# EAGLE board CPU (EAGLE 9.3.0)
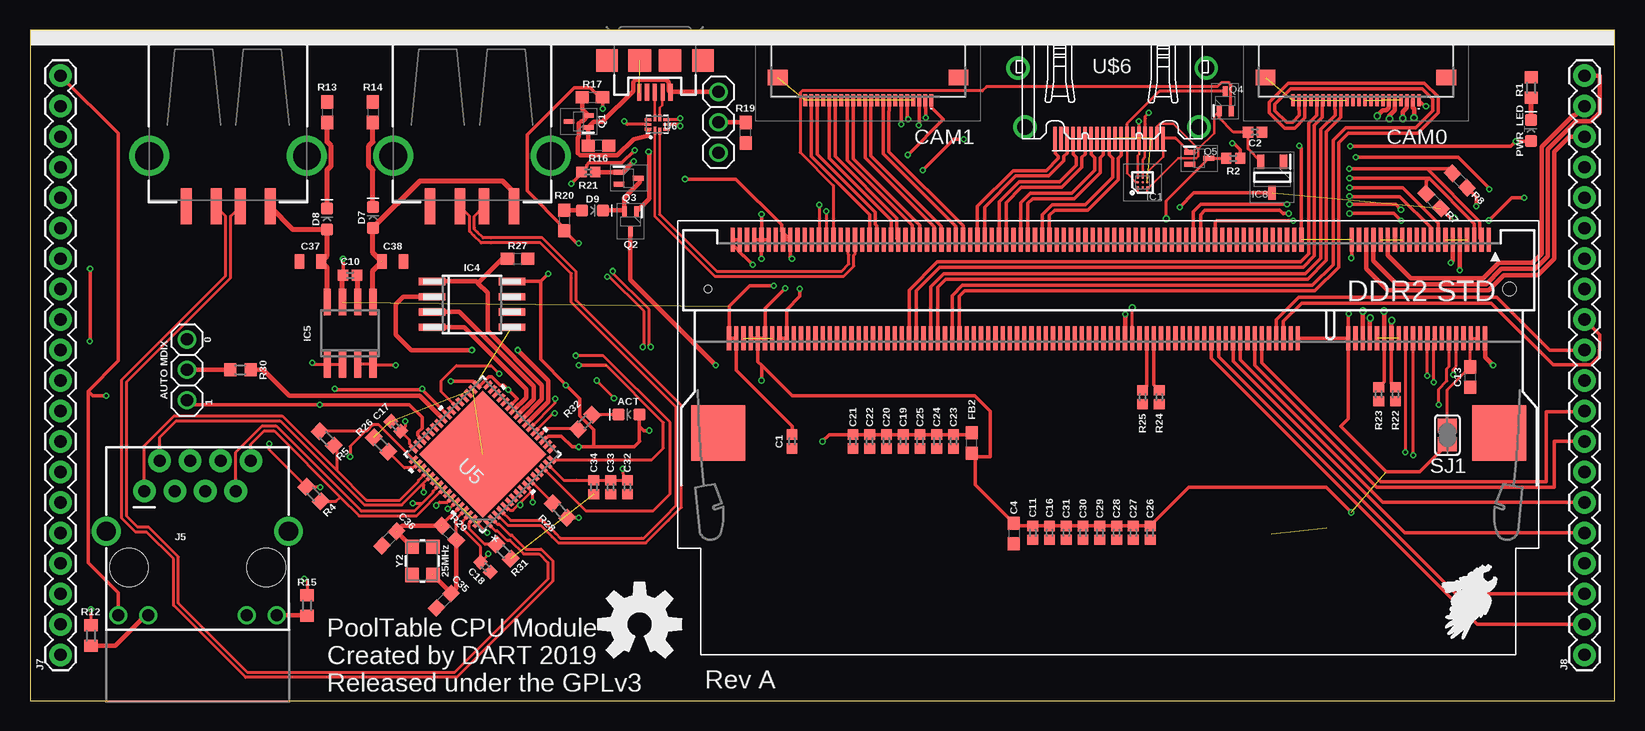
[diagram p2: board, top side]
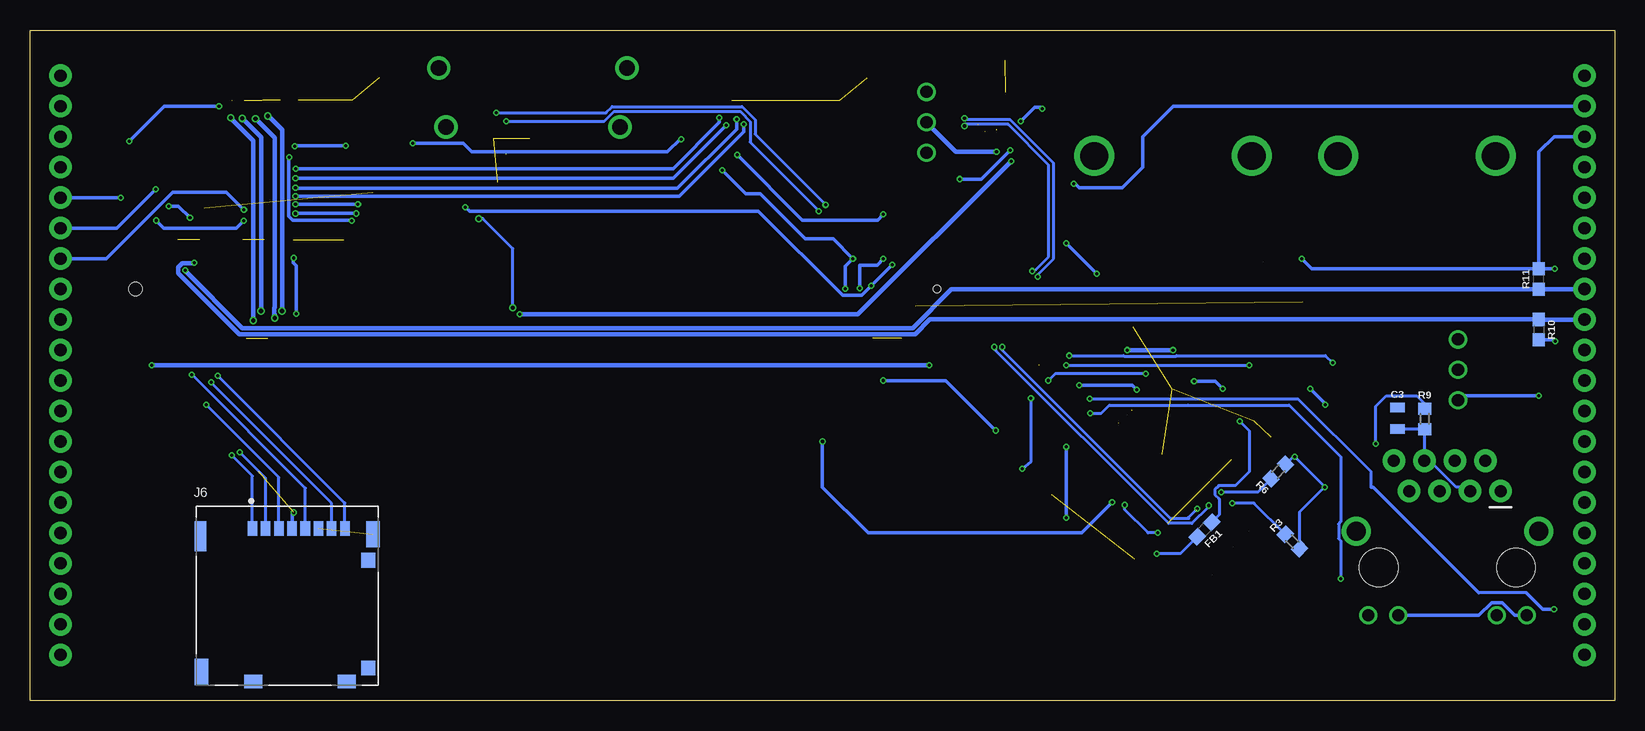
[diagram p3: board, bottom side, seen from below]

Size 132.08 x 55.88 mm. Coordinates in mm from the lower left corner, seen from the top.
Outline: 0,0 132.08,0 132.08,55.88 0,55.88 0,0
Copper layers (1*16): Top 0.035559375mm / dielectric 1.6mm / Bottom 0.035559375mm
Design rules "oshpark-2layer": minimum track width 6mil, minimum drill 10mil, track to track 6mil, track to pad 6mil, pad to pad 6mil, via to via 6mil, smd to smd 6mil, copper to edge 15mil, drill to drill 6mil, minimum pad ring 5mil, minimum via ring 5mil, stop-mask expansion 2.5mil, vias tented up to drill 0mil, thermal gap 10mil
Net classes: 0 default: width 0.254 mm; 1 diff pair: width 0.254 mm; 2 pwr: width 0.305 mm; 3 bga: width 0.152 mm

## Footprints (pad centres in the part's own frame; a part is rotated, then mirrored left to right if it is on the bottom)
0402 = smd 0.85 x 0.9: 1 -0.58,0; 2 0.58,0
0805 = smd 0.8 x 1.2: 1 -0.9,0; 2 0.9,0
0603 = smd 1.1 x 1: 1 -0.85,0; 2 0.85,0
545482271 = smd 0.3 x 1: 1 5.25,2.05; 2 4.75,2.05; 3 4.25,2.05; 4 3.75,2.05; 5 3.25,2.05; 6 2.75,2.05; 7 2.25,2.05; 8 1.75,2.05; 9 1.25,2.05; 10 0.75,2.05; 11 0.25,2.05; 12 -0.25,2.05; 13 -0.75,2.05; 14 -1.25,2.05; 15 -1.75,2.05; 16 -2.25,2.05; 17 -2.75,2.05; 18 -3.25,2.05; 19 -3.75,2.05; 20 -4.25,2.05; 21 -4.75,2.05; 22 -5.25,2.05 | smd 1.65 x 1.3: 23 -7.525,0.15; 24 7.525,0.15
RPI_COMPUTE = smd 0.35 x 2: 1 -31.38,-4.1; 2 -31.08,4.1; 3 -30.78,-4.1; 4 -30.48,4.1; 5 -30.18,-4.1; 6 -29.88,4.1; 7 -29.58,-4.1; 8 -29.28,4.1; 9 -28.98,-4.1; 10 -28.68,4.1; 11 -28.38,-4.1; 12 -28.08,4.1; 13 -27.78,-4.1; 14 -27.48,4.1; 15 -27.18,-4.1; 16 -26.88,4.1; 17 -26.58,-4.1; 18 -26.28,4.1; 19 -25.98,-4.1; 20 -25.68,4.1; 21 -25.38,-4.1; 22 -25.08,4.1; 23 -24.78,-4.1; 24 -24.48,4.1; 25 -24.18,-4.1; 26 -23.88,4.1; 27 -23.58,-4.1; 28 -23.28,4.1; 29 -22.98,-4.1; 30 -22.68,4.1; 31 -22.38,-4.1; 32 -22.08,4.1; 33 -21.78,-4.1; 34 -21.48,4.1; 35 -21.18,-4.1; 36 -20.88,4.1; 37 -20.58,-4.1; 38 -20.28,4.1; 39 -19.98,-4.1; 40 -19.68,4.1; 41 -15.78,-4.1; 42 -15.48,4.1; 43 -15.18,-4.1; 44 -14.88,4.1; 45 -14.58,-4.1; 46 -14.28,4.1; 47 -13.98,-4.1; 48 -13.68,4.1; 49 -13.38,-4.1; 50 -13.08,4.1; 51 -12.78,-4.1; 52 -12.48,4.1; 53 -12.18,-4.1; 54 -11.88,4.1; 55 -11.58,-4.1; 56 -11.28,4.1; 57 -10.98,-4.1; 58 -10.68,4.1; 59 -10.38,-4.1; 60 -10.08,4.1; 61 -9.78,-4.1; 62 -9.48,4.1; 63 -9.18,-4.1; 64 -8.88,4.1; 65 -8.58,-4.1; 66 -8.28,4.1; 67 -7.98,-4.1; 68 -7.68,4.1; 69 -7.38,-4.1; 70 -7.08,4.1; 71 -6.78,-4.1; 72 -6.48,4.1; 73 -6.18,-4.1; 74 -5.88,4.1; 75 -5.58,-4.1; 76 -5.28,4.1; 77 -4.98,-4.1; 78 -4.68,4.1; 79 -4.38,-4.1; 80 -4.08,4.1; 81 -3.78,-4.1; 82 -3.48,4.1; 83 -3.18,-4.1; 84 -2.88,4.1; 85 -2.58,-4.1; 86 -2.28,4.1; 87 -1.98,-4.1; 88 -1.68,4.1; 89 -1.38,-4.1; 90 -1.08,4.1; 91 -0.78,-4.1; 92 -0.48,4.1; 93 -0.18,-4.1; 94 0.12,4.1; 95 0.42,-4.1; 96 0.72,4.1; 97 1.02,-4.1; 98 1.32,4.1; 99 1.62,-4.1; 100 1.92,4.1; 101 2.22,-4.1; 102 2.52,4.1; 103 2.82,-4.1; 104 3.12,4.1; 105 3.42,-4.1; 106 3.72,4.1; 107 4.02,-4.1; 108 4.32,4.1; 109 4.62,-4.1; 110 4.92,4.1; 111 5.22,-4.1; 112 5.52,4.1; 113 5.82,-4.1; 114 6.12,4.1; 115 6.42,-4.1; 116 6.72,4.1; 117 7.02,-4.1; 118 7.32,4.1; 119 7.62,-4.1; 120 7.92,4.1; 121 8.22,-4.1; 122 8.52,4.1; 123 8.82,-4.1; 124 9.12,4.1; 125 9.42,-4.1; 126 9.72,4.1; 127 10.02,-4.1; 128 10.32,4.1; 129 10.62,-4.1; 130 10.92,4.1; 131 11.22,-4.1; 132 11.52,4.1; 133 11.82,-4.1; 134 12.12,4.1; 135 12.42,-4.1; 136 12.72,4.1; 137 13.02,-4.1; 138 13.32,4.1; 139 13.62,-4.1; 140 13.92,4.1; 141 14.22,-4.1; 142 14.52,4.1; 143 14.82,-4.1; 144 15.12,4.1; 145 15.42,-4.1; 146 15.72,4.1; 147 16.02,-4.1; 148 16.32,4.1; 149 16.62,-4.1; 150 16.92,4.1; 151 17.22,-4.1; 152 17.52,4.1; 153 17.82,-4.1; 154 18.12,4.1; 155 18.42,-4.1; 156 18.72,4.1; 157 19.02,-4.1; 158 19.32,4.1; 159 19.62,-4.1; 160 19.92,4.1; 161 20.22,-4.1; 162 20.52,4.1; 163 20.82,-4.1; 164 21.12,4.1; 165 21.42,-4.1; 166 21.72,4.1; 167 22.02,-4.1; 168 22.32,4.1; 169 22.62,-4.1; 170 22.92,4.1; 171 23.22,-4.1; 172 23.52,4.1; 173 23.82,-4.1; 174 24.12,4.1; 175 24.42,-4.1; 176 24.72,4.1; 177 25.02,-4.1; 178 25.32,4.1; 179 25.62,-4.1; 180 25.92,4.1; 181 26.22,-4.1; 182 26.52,4.1; 183 26.82,-4.1; 184 27.12,4.1; 185 27.42,-4.1; 186 27.72,4.1; 187 28.02,-4.1; 188 28.32,4.1; 189 28.62,-4.1; 190 28.92,4.1; 191 29.22,-4.1; 192 29.52,4.1; 193 29.82,-4.1; 194 30.12,4.1; 195 30.42,-4.1; 196 30.72,4.1; 197 31.02,-4.1; 198 31.32,4.1; 199 31.62,-4.1; 200 31.92,4.1 | smd 4.5 x 4.6: M1 -32.28,12; M2 32.82,12 | hole 1.1: -33.13,0 | hole 0.6: 33.67,0
LED-0603 = smd 1 x 1: A -0.877,0; C 0.877,0
BGA9C40P3X3_114X114X63 = smd 0.212 x 0.212: A1 -0.4,0.4; A2 0,0.4; A3 0.4,0.4; B1 -0.4,0; B2 0,0; B3 0.4,0; C1 -0.4,-0.4; C2 0,-0.4; C3 0.4,-0.4
SO-08M = smd 0.6 x 2.2: 1 -1.905,-3.33; 2 -0.635,-3.33; 3 0.635,-3.33; 4 1.905,-3.33; 5 1.905,3.33; 6 0.635,3.33; 7 -0.635,3.33; 8 -1.905,3.33
SO08 = smd 0.6 x 2.2: 1 -1.905,-2.6; 2 -0.635,-2.6; 3 0.635,-2.6; 4 1.905,-2.6; 5 1.905,2.6; 6 0.635,2.6; 7 -0.635,2.6; 8 -1.905,2.6
SOT95P285X130-3N = smd 1.15 x 0.6: 1 -1.3,0.95; 2 -1.3,-0.95; 3 1.3,0
USB-A-S-SILK-FEMALE = smd 3 x 0.9: D+ 7.212,-1; D- 7.212,1; GND 7.212,-3.5; VBUS 7.212,3.5 | drill 2.311: SHLD1 3,-6.566; SHLD2 3,6.566
USB-MICROB = smd 1.4 x 0.35: D+ -2.65,0; D- -2.65,-0.65; GND -2.65,1.3; ID -2.65,0.65; VBUS -2.65,-1.3 | smd 1.9 x 1.8: MT1 0,-4; MT2 0,4 | smd 1.9 x 1.9: P$1 0,-1.27; P$2 0,1.27
MAGJACK = drill 1 pad 1.88: 1 3.175,17.445; 2 4.445,19.985; 3 5.715,17.445; 4 6.985,19.985; 5 8.255,17.445; 6 9.525,19.985; 7 10.795,17.445; 8 12.065,19.985 | drill 1 pad 1.27: 9 1,7.1; 10 3.5,7.1; 11 11.7,7.1; 12 14.2,7.1 | drill 1.6 pad 2.184: M1 0,14.1; M2 15.2,14.1 | hole 3.2: 1.905,11.095; 13.335,11.095
MOLEX_503182-1853 = smd 0.8 x 1.24: 1 -2.9,5.605; 2 -1.8,5.605; 3 -0.7,5.605; 4 0.4,5.605; 5 1.5,5.605; 6 2.6,5.605; 7 3.7,5.605; 8 4.8,5.605 | smd 1.16 x 1.2: DET_T 6.74,-6.025 | smd 0.95 x 2.5: SH1 -7.245,4.975 | smd 1.15 x 2.2: SH2 7.145,5.125; SH5 -7.145,-6.355 | smd 1.5 x 1.15: SH3 4.94,-7.15; SH4 -2.84,-7.15 | smd 1.16 x 1.25: SW_T 6.74,2.975
1X20 = drill 1.016 pad 1.88: 1 0,0; 2 2.54,0; 3 5.08,0; 4 7.62,0; 5 10.16,0; 6 12.7,0; 7 15.24,0; 8 17.78,0; 9 20.32,0; 10 22.86,0; 11 25.4,0; 12 27.94,0; 13 30.48,0; 14 33.02,0; 15 35.56,0; 16 38.1,0; 17 40.64,0; 18 43.18,0; 19 45.72,0; 20 48.26,0
1X03 = drill 1.016: 1 -2.54,0; 2 0,0; 3 2.54,0
SOT50P160X80-3N = smd 0.9 x 0.4: 1 -0.8,0.5; 2 -0.8,-0.5; 3 0.8,0
R0603 = smd 1 x 1.1: 1 -0.85,0; 2 0.85,0
SJ = smd 1.168 x 1.6: 1 -0.762,0; 2 0.762,0
QFN64_9X9MC = smd 0.813 x 0.305: 1 -4.394,3.75; 2 -4.394,3.25; 3 -4.394,2.75; 4 -4.394,2.25; 5 -4.394,1.75; 6 -4.394,1.25; 7 -4.394,0.75; 8 -4.394,0.25; 9 -4.394,-0.25; 10 -4.394,-0.75; 11 -4.394,-1.25; 12 -4.394,-1.75; 13 -4.394,-2.25; 14 -4.394,-2.75; 15 -4.394,-3.25; 16 -4.394,-3.75; 33 4.394,-3.75; 34 4.394,-3.25; 35 4.394,-2.75; 36 4.394,-2.25; 37 4.394,-1.75; 38 4.394,-1.25; 39 4.394,-0.75; 40 4.394,-0.25; 41 4.394,0.25; 42 4.394,0.75; 43 4.394,1.25; 44 4.394,1.75; 45 4.394,2.25; 46 4.394,2.75; 47 4.394,3.25; 48 4.394,3.75 | smd 0.305 x 0.813: 17 -3.75,-4.394; 18 -3.25,-4.394; 19 -2.75,-4.394; 20 -2.25,-4.394; 21 -1.75,-4.394; 22 -1.25,-4.394; 23 -0.75,-4.394; 24 -0.25,-4.394; 25 0.25,-4.394; 26 0.75,-4.394; 27 1.25,-4.394; 28 1.75,-4.394; 29 2.25,-4.394; 30 2.75,-4.394; 31 3.25,-4.394; 32 3.75,-4.394; 49 3.75,4.394; 50 3.25,4.394; 51 2.75,4.394; 52 2.25,4.394; 53 1.75,4.394; 54 1.25,4.394; 55 0.75,4.394; 56 0.25,4.394; 57 -0.25,4.394; 58 -0.75,4.394; 59 -1.25,4.394; 60 -1.75,4.394; 61 -2.25,4.394; 62 -2.75,4.394; 63 -3.25,4.394; 64 -3.75,4.394 | smd 7.493 x 7.493: 65 0,0
IC_FSUSB42UMX = smd 0.663 x 0.225: 1 -0.518,0.2 | smd 0.563 x 0.225: 2 -0.569,-0.2; 6 0.569,-0.2; 7 0.569,0.2 | smd 0.225 x 0.563: 3 -0.4,-0.768; 4 0,-0.768; 5 0.4,-0.768; 8 0.4,0.768; 9 0,0.768; 10 -0.4,0.768
HDMI_A = smd 0.3 x 1.9: P$1 4.75,3.95; P$2 4.25,3.95; P$3 3.75,3.95; P$4 3.25,3.95; P$5 2.75,3.95; P$6 2.25,3.95; P$7 1.75,3.95; P$8 1.25,3.95; P$9 0.75,3.95; P$10 0.25,3.95; P$11 -0.25,3.95; P$12 -0.75,3.95; P$13 -1.25,3.95; P$14 -1.75,3.95; P$15 -2.25,3.95; P$16 -2.75,3.95; P$17 -3.25,3.95; P$18 -3.75,3.95; P$19 -4.25,3.95 | drill 1.3: P$20 -7.25,3; P$21 7.25,3; P$22 7.85,-1.9; P$23 -7.85,-1.9
CRYSTAL-SMD-3.2X2.5MM = smd 1.2 x 1.1: 1 -1.175,-0.875; 2 1.175,-0.875; 3 1.175,0.875; 4 -1.175,0.875

## Placement (x,y rotation side)
C1  0.1uF  [0402]  63.5,21.59 90 top
C2  0.1uF  [0402]  102.08,47.37 0 top
C3  0.022uF/50V  [0805]  18.14,23.52 270 bottom
C4  4.7uF  [0603]  81.99,13.92 270 top
C10  1.0uF  [0402]  26.67,35.43 180 top
C11  0.1uF  [0402]  83.57,13.97 90 top
C13  4.7uF  [0603]  120.04,26.95 90 top
C16  0.1uF  [0402]  84.96,13.97 270 top
C17  0.1uF  [0402]  30.48,22.86 315 top
C18  1.0uF  [0402]  37.96,11.12 135 top
C19  0.1uF  [0402]  72.77,21.59 90 top
C20  0.1uF  [0402]  71.37,21.59 90 top
C21  0.1uF  [0402]  68.58,21.59 90 top
C22  0.1uF  [0402]  69.98,21.59 90 top
C23  0.1uF  [0402]  76.96,21.59 90 top
C24  0.1uF  [0402]  75.56,21.59 90 top
C25  0.1uF  [0402]  74.17,21.59 90 top
C26  0.1uF  [0402]  93.34,13.97 90 top
C27  0.1uF  [0402]  91.95,13.97 90 top
C28  0.1uF  [0402]  90.55,13.97 90 top
C29  0.1uF  [0402]  89.15,13.97 90 top
C30  0.1uF  [0402]  87.76,13.97 90 top
C31  4.7uF  [0402]  86.36,13.97 90 top
C32  0.1uF  [0402]  49.78,17.78 90 top
C33  0.1uF  [0402]  48.39,17.78 90 top
C34  4.7uF  [0402]  46.99,17.78 90 top
C35  33pF  [0603]  34.48,8.32 225 top
C36  33pF  [0603]  29.94,13.51 225 top
C37  47uF/6.3V  [0805]  23.37,36.58 180 top
C38  47uF/6.3V  [0805]  30.23,36.58 0 top
CAM0  54548-2271  [545482271]  110.49,52.07 180 top
CAM1  54548-2271  [545482271]  69.85,52.07 180 top
CPU1  RPI_COMPUTE  [RPI_COMPUTE]  90.17,34.29 180 top
D7  GREEN  [LED-0603]  28.57,40.26 90 top
D8  GREEN  [LED-0603]  24.77,40.13 90 top
D9  GREEN  [LED-0603]  46.89,40.84 0 top
D10-FULLDUPLEX  GREEN  [LED-0603]  49.91,23.85 180 top
FB1  0.05Ω/2A  [0603]  34.21,14.25 225 bottom
FB2  0.05Ω/2A  [0603]  78.49,21.46 90 top
IC1  ESD5384NCTBG  [BGA9C40P3X3_114X114X63]  92.71,43.18 90 top
IC4  93LC66SM  [SO-08M]  36.83,33.02 270 top
IC5  MIC2026-1YM  [SO08]  26.67,30.61 0 top
IC8  AP2331W-7  [SOT95P285X130-3N]  103.5,43.61 270 top
J1  USB_A_SMT_FEMALE  [USB-A-S-SILK-FEMALE]  36.83,48.39 270 top
J2  USB_A_SMT_FEMALE  [USB-A-S-SILK-FEMALE]  16.51,48.39 270 top
J3  [USB-MICROB]  52.07,53.34 90 top
J5  MAGJACK  [MAGJACK]  6.35,0 0 top
J6  503182-1853  [MOLEX_503182-1853]  110.64,8.74 0 bottom
J7  [1X20]  2.54,3.81 90 top
J8  [1X20]  129.54,3.81 90 top
JP1  [1X03]  57.38,48.18 270 top
JP2  [1X03]  13.08,27.56 90 top
PWR_LED  GREEN  [LED-0603]  125.09,47.5 90 top
Q1  DMG1012T-7  [SOT50P160X80-3N]  45.72,48.26 180 top
Q2  DMG1012T-7  [SOT50P160X80-3N]  50.04,39.93 270 top
Q3  DMG1012T-7  [SOT50P160X80-3N]  49.89,43.54 0 top
Q4  DMG1012T-7  [SOT50P160X80-3N]  99.59,49.96 90 top
Q5  DMG1012T-7  [SOT50P160X80-3N]  97.43,45.19 0 top
R1  332R  [R0603]  125.09,51.08 270 top
R2  100K  [0402]  100.28,45.19 180 top
R3  49.9R  [R0603]  26.88,13.25 315 bottom
R4  49.9R  [R0603]  23.63,17.2 135 top
R5  49.9R  [R0603]  24.72,21.85 135 top
R6  49.9R  [R0603]  28.06,19.08 45 bottom
R7  4.7k  [0603]  116.96,41.64 315 top
R8  4.7k  [0603]  119.15,43.35 315 top
R9  10R  [R0603]  15.85,23.47 90 bottom
R10  4.7k  [0603]  6.35,30.91 270 bottom
R11  4.7k  [0603]  6.35,35.13 90 bottom
R12  332R  [R0603]  5.08,5.41 90 top
R13  150  [0603]  24.77,49.02 270 top
R14  150  [0603]  28.57,49.02 270 top
R15  332R  [R0603]  23.09,7.92 90 top
R16  47k  [0603]  47.37,46.25 180 top
R17  47k  [0603]  46.86,50.27 0 top
R19  47k  [0603]  59.64,47.32 90 top
R20  150  [0603]  44.53,40.01 270 top
R21  100K  [0402]  46.53,44.04 0 top
R22  100K  [0402]  113.79,25.53 270 top
R23  100K  [0402]  112.39,25.53 270 top
R24  100K  [0402]  94.11,25.27 270 top
R25  100K  [0402]  92.71,25.27 270 top
R26  12.4K  [R0603]  29.25,21.34 315 top
R27  10k  [0603]  40.64,36.83 0 top
R28  12.4K  [R0603]  44.15,15.84 135 top
R29  1M  [0603]  34.93,13.98 135 top
R30  10K  [R0603]  17.53,27.56 0 top
R31  12K  [R0603]  39.47,12.42 135 top
R32  332R  [R0603]  46.26,23.22 45 top
SJ1  [SJ]  118.11,22.12 270 top
U5  LAN9512-JZX  [QFN64_9X9MC]  37.72,20.52 135 top
U6  FSUSB42UMX  [IC_FSUSB42UMX]  52.27,48.01 90 top
U$1  [OSHW-LOGO-L]  50.8,6.35 0 top
U$6  HDMI-A  [HDMI_A]  90.17,50.8 180 top
Y2  25MHz  [CRYSTAL-SMD-3.2X2.5MM]  32.7,11.64 90 top

## Tracks (layer width: path | path; a pad name or v marks a point on that pad's centre or on a via)
1.8V  (via drill 0.25)
  Top 0.305: v45.11,43.08 45.95,43.92 R21.1 46.38,44.47 46.38,44.62 46.56,44.8 49.32,44.8 v50.39,45.87 | CPU1.183 CPU1.185 | CPU1.186 CPU1.184 63.05,32.57 64.16,33.68 64.16,34.27 64.14,34.29 v64.14,34.31 | v63.5,36.83 63.35,36.98 CPU1.183 | CPU1.183 62.63,39.11 62.63,39.63 58.8,43.46 v54.59,43.46 | R2.1 100.86,45.9 100.33,46.43 v100.18,46.43 | v77.83,46.79 76.99,46.79 v74.4,44.2
  Bottom 0.305: J7.19 36.83,49.53 39.37,46.99 39.37,44.45 41.07,42.75 44.65,42.75 44.98,43.08 v45.11,43.08 | v64.14,34.31 64.14,36.2 v63.5,36.83 65.15,38.48 67.46,38.48 71.22,42.24 72.44,42.24 v74.4,44.2 | v54.59,43.46 52.81,43.46 v50.39,45.87 | v100.18,46.43 95.96,46.43 95.25,45.72 78.97,45.72 77.85,46.84 77.83,46.81 v77.83,46.79
3.3V  (via drill 0.25)  (2 unrouted)
  Top 0.254: U6.9 49.78,48.01
  Top 0.305: U5.46 32.67,21.75 32.32,22.09 32.32,22.34 32.67,22.69 32.67,23.62 31.62,24.66 v24.13,24.66 13.44,24.66 JP2.1 | 32.69,25.88 34.76,23.81 U5.40 U5.39 | v25.4,25.98 25.5,25.88 32.69,25.88 | U5.19 42.83,21.69 43.18,22.03 44.29,22.03 45.19,21.13 v45.72,21.13 46.99,21.13 | 46.99,21.13 50.34,21.13 50.8,21.59 50.79,21.6 50.79,22.86 | 50.79,22.86 D10-FULLDUPLEX.A | J7.20 7.35,47.26 7.35,28.3 4.84,25.79 | J5.9 7.35,8.98 4.84,11.49 4.84,25.79 | v47.73,49.3 47.71,49.31 R17.2 47.49,50.27 46.69,51.07 45.34,51.07 41.43,47.16 41.43,42.47 44.53,39.37 R20.2 45.58,38.1 v45.72,38.1 | 49.78,48.01 v49.52,48.27 | 4.84,25.79 5.24,25.4 v6.35,25.4 | IC4.8 42.55,34.92 | 42.55,34.92 v43.18,35.56 | CPU1.193 CPU1.191 | CPU1.189 CPU1.191 | CPU1.194 CPU1.192 | CPU1.192 CPU1.190 61.25,32.67 v62.94,34.37 | v60.96,36.83 v60.95,36.84 CPU1.191 | FB2.1 78.78,20.32 | 78.78,20.32 80.01,20.32 80.01,24.13 78.74,25.4 63.5,25.4 60.96,27.94 | CPU1.192 60.65,28.25 60.96,27.94 | CAM1.22 75.1,49.46 76.12,48.44 73.18,45.49 73.15,45.49 v73.15,45.47 | v60.96,40.51 CPU1.191 | R28.1 v45.72,15.24 | 60.96,27.94 v60.96,26.67 | v51.59,22.5 51.14,22.5 50.79,22.86 | 78.78,20.32 78.78,17.98 C4.1 82.21,14.55 C11.2 C16.1 C31.2 C30.2 C29.2 C28.2 C27.2 C26.2 96.58,17.78 108,17.78 v110.11,15.67 | CPU1.40 CPU1.42 | CPU1.40 109.85,32.2 v109.88,32.23 | v110.11,36.88 110.15,36.92 CPU1.39 | SJ1.2 115.8,19.05 113.03,19.05 109.22,22.86 109.85,23.49 CPU1.40 | CAM0.22 116.23,49.53 v116.33,49.53 | PWR_LED.A v123.8,46.61 123.39,46.2 v110.03,46.2 | U5.27 40.59,25.16 v39.86,25.89 39.47,26.28 39.18,26.28 38.48,26.98 38.23,26.98 37.53,26.28 U5.33 36.92,26.63 36.6,26.63 36.59,26.62 v35.08,26.62
  Top 0.305: v32.69,25.98 32.69,25.88 | 42.55,34.92 42.55,28.42 44.68,26.29 | 44.68,26.29 v44.65,26.26 | 44.68,26.29 45.82,25.15 45.82,23.73 46.99,22.56 46.99,21.13 | CPU1.41 105.95,46.04 v105.77,46.23
  Bottom 0.305: v25.4,25.98 24.13,24.71 v24.13,24.66 | J5.9 8.36,7.1 9.41,8.15 10.29,8.15 11.34,7.1 J5.11 | v49.52,48.27 48.34,49.45 47.88,49.45 v47.73,49.3 | v6.35,25.4 12.7,25.4 JP2.1 | v43.18,35.56 v45.72,38.1 | v62.94,34.37 62.94,36.3 61.49,36.3 v60.96,36.83 | v73.15,45.47 67.72,40.03 61.44,40.03 v60.96,40.51 | v45.72,15.24 v45.72,21.13 | v60.96,26.67 55.75,26.67 v51.59,22.5 | J6.4 110.24,15.54 v110.11,15.67 | v109.88,32.23 109.88,36.22 110.13,36.47 110.13,36.85 v110.11,36.88 | v116.33,49.53 120.88,49.53 v123.8,46.61 | v35.08,26.62 33.32,26.62 v32.69,25.98 | v44.65,26.26 40.23,26.26 v39.86,25.89 | v105.77,46.23 110.01,46.23 v110.03,46.2
5V  (via drill 0.25)  (2 unrouted)
  Top 0.305: v5,35.99 5,29.97 v4.98,29.95 | C10.2 v26.09,36.8 | CPU1.197 CPU1.199 58.55,37.98 59.45,37.09 59.46,37.09 v60.22,36.32 | 62,34.57 v61.98,34.57 59.97,34.57 58.25,32.85 CPU1.200 CPU1.198 58.85,27.51 63.5,22.86 C1.2 | R7.2 118.36,40.23 v118.75,40.23 | v120.52,41.2 120.52,41.97 R8.2 | IC8.3 97,42.31 v95.81,41.12
  Top 0.406: IC5.7 26.04,35.38 C10.2
  Bottom 0.305: R11.2 6.35,45.72 5.08,46.99 J7.18 | R11.2 5.02,35.98 v5,35.99 | v4.98,29.95 5.09,30.06 R10.2 | R11.2 25.26,35.98 v26.09,36.8 | v60.22,36.32 60.25,36.32 60.27,36.3 60.27,36.27 v61.98,34.57 62.38,34.16 62.38,34.13 62.76,33.76 64.37,33.76 71.37,40.76 95.45,40.76 v95.81,41.12 | v118.75,40.23 119.71,41.2 v120.52,41.2
CAM0_C_N
  Top 0.305: CPU1.144 75.05,34.51 76.13,35.59 106.28,35.59 107.57,36.87 107.57,47.59 108.76,48.79 108.76,49.25 108.74,49.27 CAM0.8
CAM0_C_P
  Top 0.305: CPU1.142 75.65,34.46 76.32,35.13 106.47,35.13 108.03,36.69 108.03,47.4 109.22,48.6 109.22,50 CAM0.9
CAM0_D0_N
  Top 0.305: CPU1.138 76.85,33.74 77.71,34.59 106.86,34.59 108.58,36.31 108.58,46.68 109.66,47.75 115.47,47.75 116.89,49.17 116.89,50.12 116.01,51 105.05,51 103.73,49.69 103.73,49.17 104.72,48.18 105.21,48.18 105.79,48.76 105.79,49.17 105.74,49.23 CAM0.2
CAM0_D0_P
  Top 0.305: CPU1.136 77.45,33.69 77.89,34.14 107.05,34.14 109.04,36.13 109.04,46.49 109.85,47.3 115.67,47.3 117.35,48.98 117.35,50.31 116.2,51.46 104.86,51.46 103.28,49.88 103.28,48.98 104.55,47.7 105.38,47.7 106.25,48.57 106.25,49.36 106.24,49.37 CAM0.3
CAM0_D1_N
  Top 0.305: CPU1.150 73.25,34.2 75.62,36.58 105.9,36.58 106.58,37.26 106.58,48.13 107.24,48.79 107.24,49.4 CAM0.5
CAM0_D1_P
  Top 0.305: CAM0.6 107.7,49.96 107.7,49.83 107.7,48.6 107.04,47.94 107.04,37.07 106.09,36.12 75.81,36.12 73.85,34.16 CPU1.148
CAM1_C_N
  Top 0.305: CAM1.8 68.1,45.01 73.52,39.59 73.52,38.42 CPU1.149
CAM1_C_P
  Top 0.305: CAM1.9 68.6,45.16 74.15,39.61 CPU1.147
CAM1_D0_N
  Top 0.305: CAM1.2 65.1,45.36 65.11,45.36 69.98,40.49 69.98,38.42 CPU1.161
CAM1_D0_P
  Top 0.305: CAM1.3 65.6,45.52 70.43,40.68 70.43,39.7 70.55,39.58 CPU1.159
CAM1_D1_N
  Top 0.305: CAM1.5 66.6,45.19 71.78,40.01 71.78,38.42 CPU1.155
CAM1_D1_P
  Top 0.305: CAM1.6 67.1,45.34 72.24,40.2 72.24,38.5 CPU1.153
CAM1_D2_N
  Top 0.305: CPU1.143 75.35,39.47 69.6,45.22 69.6,49.28 CAM1.11
CAM1_D2_P
  Top 0.305: CPU1.141 75.95,39.51 70.05,45.41 70.05,49.39 70.06,49.4 70.06,49.98 CAM1.12
CAM1_D3_N
  Top 0.305: CPU1.137 77.15,39.52 71.12,45.55 71.12,49.12 71.12,50 CAM1.14
CAM1_D3_P
  Top 0.305: CPU1.135 77.75,39.57 71.58,45.74 71.58,49.12 71.6,49.15 CAM1.15
EMMC_DISABLE_N  (via drill 0.25)
  Top 0.356: Q2.3 50.04,35.05 v57.15,27.94 | v121.92,27.94 121.25,28.61 CPU1.2
  Bottom 0.356: v57.15,27.94 v121.92,27.94
EMMC_EN_N_1V8  (via drill 0.25)
  Top 0.356: R21.2 47.12,44.04 Q3.1 49.4,44.04 v50.32,44.96 | v91.26,32.18 91.26,30.2 CPU1.90
  Bottom 0.356: v50.32,44.96 63.09,32.18 v91.26,32.18
ETH_18ETHPLL  (via drill 0.25)
  Top 0.254: U5.48 31.96,21.07 31.64,21.4 31.64,21.7 C17.2 31.27,22.83 v31.27,23.29
  Bottom 0.254: v31.27,23.29 30.48,22.5 30.48,19.05 31.62,17.91 33.04,17.91 33.35,17.59 33.35,17.15 32.99,16.8 32.99,15.47 FB1.1
ETH_18USBPLL  (via drill 0.25)
  Top 0.254: U5.62 36.04,14.96 36.04,14.3 37.55,12.8 C18.2 38.18,12.16 v38.18,12.24
  Bottom 0.254: FB1.2 36.22,12.24 v38.18,12.24
ETH_EECLK  (via drill 0.25)  (1 unrouted)
  Top 0.356: 41.38,23.1 43.18,24.9 43.18,26.67 v40.64,29.21 | v36.83,29.21 31.75,29.21 30.48,30.48 30.48,33.02 31.11,33.66 IC4.2
  Bottom 0.356: v40.64,29.21 v36.83,29.21
ETH_EECS
  Top 0.356: IC4.1 37.19,34.92 37.33,34.78 | 37.33,34.78 38.12,33.98 38.12,30.81 42.65,26.29 42.65,25.1 U5.24 | 37.33,34.78 39.37,36.83 R27.1
ETH_EEDI  (1 unrouted)
  Top 0.356: IC4.4 36.2,31.11 41.35,25.96 41.35,25.24 40.28,24.17
ETH_EEDO  (1 unrouted)
  Top 0.356: IC4.3 35.76,32.38 41.96,26.19 41.96,25.13 U5.25
ETH_PWR2
  Top 0.406: IC5.8 24.77,36.08 C37.1 24.77,37.07 D8.A 21.93,39.26 J2.VBUS
ETH_PWR3  (2 unrouted)
  Top 0.406: IC5.5 28.57,35.83 C38.1 28.57,37.33 D7.A 32.5,43.31 39.37,43.31 40.39,42.29 40.39,41.23 J1.VBUS
ETH_USB_D2_N
  Top 0.254: U5.1 38.79,14.15 38.91,14.15 38.91,14.19 39.73,13.37 39.99,13.37 41.14,12.22 42.44,12.22 43.16,11.5 43.16,10.12 35.37,2.34 18.14,2.34 12.37,8.11 12.37,11.97 9.89,14.45 8.97,14.45 8.05,15.38 8.05,26.56 16.71,35.22 16.71,40.38 J2.D-
ETH_USB_D2_P
  Top 0.254: U5.2 38.94,14.71 39.1,14.71 40.02,13.78 40.15,13.78 41.31,12.62 42.6,12.62 43.56,11.67 43.56,9.95 35.54,1.93 17.98,1.93 11.96,7.94 11.96,11.8 9.72,14.05 8.81,14.05 7.64,15.21 7.64,26.73 16.31,35.39 16.31,40.38 J2.D+
ETH_USB_D3_N
  Top 0.254: U5.3 38.96,15.47 39.82,14.61 40.23,14.61 42.04,14.61 42.56,14.61 43.52,13.65 44.04,13.13 50.98,13.13 51.32,13.13 53.2,15.02 54.28,16.1 54.28,17.91 54.28,24.59 45.99,32.88 45.52,33.36 45.52,35.23 45.52,35.75 43.22,38.04 42.7,38.56 38.41,38.56 37.75,38.56 37.28,39.03 37.03,39.28 | 37.03,39.28 37.03,39.42 | 37.03,39.28 37.03,40.38 J1.D-
ETH_USB_D3_P
  Top 0.254: U5.4 40.05,15.01 40.23,15.01 42.04,15.01 42.73,15.01 43.81,13.94 44.2,13.54 50.98,13.54 51.15,13.54 52.92,15.31 53.87,16.26 53.87,17.91 53.87,24.43 45.7,32.6 45.11,33.19 45.11,35.23 45.11,35.58 42.94,37.75 42.54,38.15 38.41,38.15 37.58,38.15 36.99,38.74 36.63,39.11 36.63,39.37 | 36.63,39.37 36.63,39.42 | 36.63,39.37 | 36.63,39.37 36.63,40.38 J1.D+
ETH_USBD_N  (via drill 0.25)  (1 unrouted)
  Top 0.254: U5.58 34.8,16.54 34.14,16.54 v33.86,16.26 | v51.71,29.46 51.59,29.46 51.59,32.6 48.48,35.7 v48.57,35.79 | v54.2,47.88 54.2,48.01 53.22,48.01 53.21,48 U6.4
  Bottom 0.254: v33.86,16.26 33.86,16.15 35.25,14.76 37.19,14.76 51.59,29.15 51.59,29.46 v51.71,29.46 | v48.57,35.79 48.48,35.7 47.19,36.99 47.19,44.62 50.58,48.01 54.2,48.01 v54.2,47.88
ETH_USBD_P  (via drill 0.25)  (1 unrouted)
  Top 0.254: U5.59 34.86,15.88 34.86,15.92 v34.8,15.98 | v51.05,29.46 51.18,29.46 51.18,32.43 48.19,35.42 v48.1,35.33 | v54.2,48.54 54.2,48.41 U6.5
  Bottom 0.254: 35.52,15.16 35.56,15.16 | 35.56,15.16 37.02,15.16 51.18,29.32 51.18,29.46 v51.05,29.46 | 34.87,15.9 35.56,15.24 35.56,15.16 | v48.1,35.33 48.19,35.42 46.79,36.82 46.79,44.79 50.41,48.41 54.2,48.41 v54.2,48.54
ETH_VDD18CORE  (via drill 0.25)
  Top 0.254: U5.15 44.47,18.36 45.54,18.36 45.55,18.36 C34.2 C33.2 C32.2 49.48,18.67 49.43,19.13 49.4,19.15 v49.4,19.3 | U5.38 34.29,25.72 34.29,26.67 35.53,27.91 38.43,27.91 v39.12,27.23 | v47.22,26.67 48.67,25.22 v48.67,25.2
  Bottom 0.254: v39.12,27.23 46.66,27.23 v47.22,26.67 | v48.67,25.2 48.67,19.91 v49.4,19.3
ETH_VDD33A  (via drill 0.25)  (4 unrouted)
  Top 0.254: 27.94,22.45 28.06,22.45 28.57,22.96 29.06,22.96 U5.49 | 27.94,22.45 R5.2 | 27.94,22.45 26.67,21.18 v26.67,20.32 | v24.18,17.78 23.05,17.78 R4.2 19.94,20.89 v19.94,21.41 | U5.5 39.69,16.18 40.01,15.86 40.24,15.86 40.77,16.39 | 41.73,17.48 41.73,17.35 40.77,16.39 | 41.73,17.48 41.36,17.85 U5.10 | U5.64 38.06,13.97 v38.1,13.97 | v40.85,16.3 40.77,16.39 | 40.77,16.39 | v41.91,16.51 41.91,17.3 41.73,17.48
  Top 0.305: FB2.2 78.34,22.17 C23.2 C24.2 C25.2 C19.2 C20.2 C22.2 C21.2 66.62,22.17 v66.04,21.59
  Bottom 0.254: R6.2 26.82,20.32 v26.67,20.32 24.18,17.83 | 24.18,17.83 v24.18,17.78 | R3.2 26.28,15.73 24.18,17.83 | v19.94,21.41 19.94,24.51 19.05,25.4 16.51,25.4 15.85,24.74 R9.2 | v38.1,13.97 38.91,13.97 40.84,15.9 40.84,16.28 v40.85,16.3
  Bottom 0.305: v41.91,16.51 44.45,13.97 62.23,13.97 66.04,17.78 v66.04,21.59
GND  (26 unrouted)
  Top 0.406: IC5.6 27.3,35.38 C10.1
  cutout Top (isolate 0.102): -1.27,57.15 -1.27,-1.27 0,-1.27 133.35,-1.27 133.35,57.15
  cutout Bottom: -2.54,58.42 134.62,58.42 134.62,-2.54 -2.54,-2.54
GPIO0  (via drill 0.25)
  Top 0.305: CPU1.3 120.83,38.51 120.83,39.91 116.42,44.32 | 116.42,44.32 v109.93,44.32 | v74.66,48.56 74.63,48.59 74.63,49.38 74.59,49.42 CAM1.21 | R8.1 118.17,44.32 116.42,44.32
  Bottom 0.305: v109.93,44.32 78.49,44.32 74.62,48.18 74.62,48.51 74.66,48.55 v74.66,48.56
GPIO1  (via drill 0.25)
  Top 0.305: CAM1.20 74.1,48.05 74.12,48.03 74.12,47.98 v74.07,47.93 | v109.96,43.51 116.59,43.51 | 116.59,43.51 120.34,39.75 CPU1.5 | R7.1 116.36,43.28 116.59,43.51
  Bottom 0.305: v74.07,47.93 78.46,43.54 109.96,43.54 v109.96,43.51
GPIO4  (via drill 0.25)
  Top 0.305: CAM1.18 73.1,48.54 v73.2,48.44 | v109.96,42.72 114.4,42.72 117.35,39.78 CPU1.15
  Bottom 0.305: v73.2,48.44 73.2,47.62 78.13,42.7 109.93,42.7 v109.96,42.72
GPIO5  (via drill 0.25)
  Top 0.305: CPU1.17 116.76,39.39 114.16,41.99 109.98,41.99 v109.96,42.01 | v72.59,48.03 CAM1.17
  Bottom 0.305: v109.96,42.01 77.98,42.01 72.59,47.4 v72.59,48.03
GPIO28  (via drill 0.35)  (1 unrouted)
  Top 0.305: R22.1 113.45,26.45 CPU1.28
  Top 0.356: CPU1.28 113.45,31.59 113.48,31.62 v113.48,31.67 | v115.34,48.56 115.34,49.3 115.25,49.4 CAM0.21
  Bottom 0.356: v113.48,31.67 113.48,46.66 115.37,48.54 v115.34,48.56
GPIO29  (via drill 0.35)
  Top 0.305: R23.1 112.85,26.56 CPU1.30
  Top 0.356: CPU1.30 112.85,31.75 112.85,32.44 v112.83,32.46 | CAM0.20 114.72,50 114.72,49.38 114.4,49.06 v114.4,48.51
  Bottom 0.356: v112.83,32.46 112.83,46.94 v114.4,48.51
GPIO30  (via drill 0.35)  (1 unrouted)
  Top 0.356: CPU1.34 111.65,31.84 v111.68,31.88 | v113.28,48.49 113.28,48.73 113.75,49.19 CAM0.18
  Bottom 0.356: v111.68,31.88 111.68,32.17 111.71,32.2 111.71,32.72 111.68,32.75 111.68,46.91 113.26,48.49 v113.28,48.49
GPIO31  (via drill 0.35)
  Top 0.356: CPU1.36 111.05,31.67 111.05,32.44 v111.07,32.46 | v112.27,48.72 112.74,49.19 113.03,49.19 113.24,49.4 CAM0.17
  Bottom 0.356: v111.07,32.46 111.07,47.57 112.22,48.72 v112.27,48.72
GPIO32
  Top 0.305: CPU1.46 104.45,31.6 105.97,33.12 121.78,33.12 126.94,27.96 130.06,27.96 130.78,28.69 130.78,29.18 130.81,29.21 130.81,30.48 J8.12
GPIO33
  Top 0.305: CPU1.48 103.85,31.74 105.74,33.63 122.22,33.63 126.64,29.21 J8.11
GPIO34
  Top 0.305: CPU1.52 102.65,28.16 112.57,18.24 126.34,18.24 126.34,24.08 129.54,24.08 J8.9
GPIO35
  Top 0.305: CPU1.54 102.05,27.95 112.22,17.78 127,17.78 127,21.59 J8.8
GPIO36
  Top 0.305: CPU1.58 100.85,28.39 112.72,16.51 J8.6
GPIO37
  Top 0.305: CPU1.60 100.25,28.27 114.55,13.97 J8.5
GPIO38
  Top 0.305: CPU1.64 99.05,28.66 118.82,8.89 J8.3
GPIO39
  Top 0.305: CPU1.66 98.45,28.52 120.62,6.35 J8.2
GPIO44
  Top 0.305: R24.1 93.65,26.31 CPU1.82
GPIO45
  Top 0.305: R25.1 93.05,26.19 CPU1.84
H5V
  Top 0.203: 97.36,46 95.29,48.08 94.15,48.08 93.92,47.84 U$6.P$18 | IC1.A1 92.31,42.31 93.11,42.31 IC1.C1 93.12,42.8 93.27,42.8 95.68,45.21 97.2,45.21 97.36,45.37 97.36,45.97 98.67,47.28 98.67,48.74 Q4.1
  Top 0.254: 97.36,45.97 97.36,46 | Q4.1 99.09,48.56 100.28,47.37 C2.1 101.5,45.96 IC8.2
HDMI_CEC
  Top 0.254: CPU1.171 66.95,42.9 64.17,45.68 64.17,50.64 64.33,50.8 79.36,50.8 79.73,51.17 98.95,51.17 99.28,51.49 99.91,51.49 100.07,51.33 100.07,49.18 Q4.2
HDMI_CK_N
  Top 0.305: CPU1.111 84.95,40.43 85.39,40.87 88.13,40.87 90.68,43.42 90.68,45.19 90.92,45.43 U$6.P$12
HDMI_CK_P
  Top 0.305: CPU1.113 84.35,40.48 85.2,41.33 87.94,41.33 90.22,43.6 90.22,45.19 89.92,45.49 U$6.P$10
HDMI_D0_N
  Top 0.305: CPU1.117 83.15,41.42 83.56,41.83 87.01,41.83 89.18,44 89.18,45.24 89.42,45.48 U$6.P$9
HDMI_D0_P
  Top 0.305: CPU1.119 82.55,41.47 83.37,42.29 86.82,42.29 88.72,44.19 88.72,45.24 88.42,45.54 U$6.P$7
HDMI_D1_N
  Top 0.305: CPU1.123 81.35,41.5 82.62,42.77 86,42.77 87.66,44.43 87.66,45.26 87.92,45.53 U$6.P$6
HDMI_D1_P
  Top 0.305: CPU1.125 80.75,41.55 82.43,43.23 85.81,43.23 87.2,44.62 87.2,45.26 86.92,45.54 U$6.P$4
HDMI_D2_N
  Top 0.305: CPU1.129 79.55,41.13 82.14,43.71 84.88,43.71 86.16,44.99 86.16,45.34 86.42,45.6 U$6.P$3
HDMI_D2_P
  Top 0.305: CPU1.131 78.95,41.17 81.95,44.17 84.69,44.17 85.7,45.18 85.7,45.34 85.42,45.62 U$6.P$1
HDMI_HPD_N_1V8  (via drill 0.35)
  Top 0.254: R2.2 Q5.3 94.69,41.64 v94.69,40.16 | CPU1.88 91.85,32.13 v91.85,32.74
  Bottom 0.254: v91.85,32.74 91.85,37.67 94.34,40.16 v94.69,40.16
HDMI_SCL  (via drill 0.25)
  Top 0.203: IC1.B3 92.71,45.09 92.91,45.29 U$6.P$16
  Top 0.254: U$6.P$16 92.92,48.05 92.94,48.06 92.94,48.51 92.92,48.52 92.92,48.67 v93.22,48.97 | v65.79,41.3 65.79,38.43 CPU1.175
  Bottom 0.254: v93.22,48.97 84.1,48.97 83.56,49.51 72.74,49.51 71.65,48.42 71.65,47.19 65.76,41.3 v65.79,41.3
HDMI_SDA  (via drill 0.25)  (1 unrouted)
  Top 0.203: IC1.A3 92.31,45.42 92.43,45.54 | 92.42,45.55 U$6.P$15
  Top 0.254: U$6.P$15 92.42,48.27 v92.41,48.28 | v66.34,40.77 CPU1.173
  Bottom 0.254: v92.41,48.28 84.21,48.28 83.4,49.1 72.91,49.1 72.06,48.25 72.06,46.53 66.34,40.82 v66.34,40.77
N$1
  Top 0.406: PWR_LED.C R1.2
N$3
  Bottom 0.254: J5.3 12.4,17.78 13.22,17.78 15.42,19.98 J5.6 15.85,20.01 R9.1 | R9.1 | R9.1 C3.2
N$4
  Top 0.254: U5.50 32.22,19.71 31.9,19.39 31.2,19.39 R26.2
N$5
  Top 0.254: U5.11 43.55,16.46 R28.2
N$6
  Top 0.203: IC1.C3 93.11,44.01 94.42,45.32 U$6.P$19
  Top 0.254: Q5.1 95.47,46.85 U$6.P$19
N$7  (2 unrouted)
  Top 0.254: 35.53,13.84 R29.1 35.53,15.15 U5.61
  Top 0.356: Y2.1 35.08,8.96 C35.1 35.53,9.37 R29.1
N$8  (3 unrouted)
  Top 0.254: U5.60 35.8,16.13 35.8,16.1
  Top 0.305: 35.8,16.1 34.33,14.63 R29.2
  Top 0.356: R29.2 31,14.58 C36.1 Y2.3
N$9
  Top 0.203: IC1.A2 92.3,43.2 92.15,43.2 91.42,43.92 U$6.P$13
  Top 0.254: Q4.3 94.12,50.76 91.42,48.06 U$6.P$13
N$10  (via drill 0.25)
  Top 0.254: U5.14 46.33,15.8 51.92,15.8 53.34,17.22 53.34,23.18 47.77,28.75 v45.49,28.75 | v23.52,28.14 23.66,28.01 IC5.1 IC5.2
  Bottom 0.254: v23.52,28.14 24.13,28.75 36.53,28.75 36.61,28.68 40.86,28.68 40.94,28.75 v45.49,28.75
N$11  (via drill 0.25)  (1 unrouted)
  Top 0.254: U5.16 51.82,20.07 52.78,21.03 52.78,23.16 48.01,27.94 | v30.48,27.94 28.64,27.94 IC5.4 IC5.3
  Top 0.305: v45.73,27.95 47.98,27.93 47.99,27.92
  Bottom 0.254: v45.73,27.95 v30.49,27.93 v30.48,27.94
N$12
  Top 0.356: R12.1 7.09,4.56 9.63,7.1 J5.10
N$13
  Top 0.356: U5.41 32.49,25.4 21.59,25.4 19.43,27.56 R30.2
N$14
  Top 0.356: JP2.2 R30.1
N$15
  Top 0.356: J5.12 23.06,7.1 R15.1
N$16
  Top 0.406: D8.C 24.77,44.22 25.09,44.55 25.09,46.22 24.77,46.55 R13.2
N$17
  Top 0.406: D7.C 28.57,44.22 28.25,44.55 28.25,46.22 28.57,46.55 R14.2
N$18
  Top 0.229: U6.7 J3.D+
  Top 0.305: J3.D+
N$19  (1 unrouted)
  Top 0.356: R17.1 46.01,49.27 Q1.2 46.05,48.29 45.93,48.29 45.74,48.1 45.74,46.99 45.64,46.89 45.64,45.62 45.83,45.42 48.95,45.42 50.29,46.76 51.5,47.09 51.5,47.54
N$20
  Top 0.229: U6.6 52.47,49.39 52.7,49.62 52.7,50.67
  Top 0.254: J3.D- 52.7,50.67
N$21  (via drill 0.25)
  Top 0.356: JP1.2 59.63,48.18 R19.2 | Q2.1 51.62,41.81 51.62,45.72 v51.54,45.72
  Bottom 0.356: v51.54,45.72 54.91,45.72 JP1.2
N$22
  Top 0.356: D9.C 49.42,40.84 Q2.2 49.53,41.91 50.8,43.18 50.8,43.42 Q3.3
N$23
  Top 0.356: D9.A 44.54,40.84 R20.1
N$24
  Top 0.254: R31.2 37.9,13.02 36.59,14.33 36.59,14.8 U5.63
N$26
  Top 0.254: R32.2 46.89,23.85 D10-FULLDUPLEX.C
N$28
  Top 0.254: U5.20 43.06,22.68 45.6,22.68 R32.1
NLNKA  (via drill 0.25)
  Top 0.254: U5.21 43.6,23.93 v43.71,23.93 | v22.86,10.16 23.09,9.93 R15.2
  Bottom 0.254: v43.71,23.93 42.82,23.93 42.14,24.61 35.56,24.61 27.15,24.61 22.86,20.32 22.86,14.88 23.03,14.71 23.03,13.49 22.86,13.32 v22.86,10.16
NSPD  (via drill 0.25)
  Top 0.254: U5.22 43.76,24.8 v43.76,25.15 | v5.08,7.62 R12.2
  Bottom 0.254: v43.76,25.15 26.42,25.15 20.32,19.05 20.32,17.78 | 7.38,8.99 11.33,8.99
  Bottom 0.305: 7.38,8.99 6.01,7.62 v5.08,7.62 | 11.33,8.99 20.13,17.78 20.32,17.78
RX_N  (via drill 0.25)
  Top 0.254: J5.2 10.79,21.94 12.18,23.32 20.84,23.32 27.86,16.31 31,16.31 32.74,18.05 | 32.74,18.05 33.34,18.65 U5.53 | v32.82,17.37 32.82,17.98 32.74,18.05
  Bottom 0.254: R6.1 29.76,17.37 v32.82,17.37
RX_P
  Top 0.254: J5.1 9.53,21.24 12.01,23.72 21.01,23.72 25.54,19.19 | 25.54,19.19 28.02,16.71 30.83,16.71 32.39,18.28 32.39,18.38 U5.52 | R5.1 25.54,21.03 25.54,19.19
SCL1  (via drill 0.25)
  Top 0.356: v118.39,36.5 118.55,36.66 CPU1.11
  Bottom 0.356: J7.12 6.34,31.75 R10.1 57.09,31.76 58.32,30.53 114.65,30.53 119.74,35.62 119.74,36.11 119.39,36.45 118.44,36.45 v118.39,36.5
SD_CLK  (via drill 0.25)
  Top 0.254: v118.61,27.14 118.61,27.63 118.85,27.87 CPU1.10
  Bottom 0.254: J6.5 109.14,17.7 118.58,27.14 v118.61,27.14
SD_CMD  (via drill 0.25)
  Top 0.254: v117.4,24.66 117.4,25.96 118.08,26.64 118.08,27.67 118.25,27.84 CPU1.12
  Bottom 0.254: J6.3 111.34,18.61 v117.4,24.66
SD_D0  (via drill 0.25)
  Top 0.254: v116.99,26.52 116.99,30.13 CPU1.16
  Bottom 0.254: J6.7 106.94,16.44 117.02,26.52 v116.99,26.52
SD_D1  (via drill 0.25)
  Top 0.254: v116.43,27.05 116.43,30.17 CPU1.18
  Bottom 0.254: J6.8 105.84,16.46 v116.43,27.05
SD_D2  (via drill 0.25)
  Top 0.254: v115.27,20.45 115.25,20.46 CPU1.22
  Bottom 0.254: J6.1 113.54,18.72 v115.27,20.45
SD_D3  (via drill 0.25)
  Top 0.254: v114.61,20.7 114.65,20.75 CPU1.24
  Bottom 0.254: J6.2 112.44,18.54 v114.61,20.7
SD_VREF
  Top 0.254: C13.2 120.04,27.81 | 120.04,27.81 CPU1.6 CPU1.4 | SJ1.1 118.11,25.88 120.04,27.81
SDA1  (via drill 0.25)
  Top 0.356: v119.15,35.87 CPU1.9
  Bottom 0.356: J7.13 6.34,34.29 R11.1 55.3,34.28 58.53,31.04 114.38,31.04 119.18,35.84 v119.15,35.87
SPI0_MISO
  Top 0.356: CPU1.29 113.14,37.13 115.06,35.2 120.65,35.2 121.12,35.2 122.39,36.47 123.19,36.47 | J8.19 128.78,48.77 128.61,48.77 125.98,46.14 125.98,37.25 125.21,36.47 123.19,36.47 | 122.95,36.47 123.19,36.47
SPI0_MOSI
  Top 0.356: CPU1.33 111.95,36.64 113.89,34.7 121.33,34.7 122.61,35.97 123.19,35.97 | J8.20 130.81,52.07 130.81,49 130.07,48.26 129.54,48.26 128.82,48.26 126.49,45.93 126.49,37.04 125.42,35.97 123.19,35.97 | 122.78,35.97 123.19,35.97
SPI0_SCLK
  Top 0.356: CPU1.35 111.35,35.97 113.13,34.19 121.55,34.19 122.81,35.46 125.63,35.46 127,36.83 127,45.72 128.27,46.99 J8.18
SPI1_MISO  (via drill 0.25)
  Top 0.305: CPU1.65 98.75,39.85 98.88,39.98 v105.26,39.98 | v110.49,45.29 119.02,45.29 121.69,42.62 v121.61,42.62
  Bottom 0.305: v105.26,39.98 105.31,40.03 110.19,40.03 110.52,40.36 110.52,45.29 v110.49,45.29 | v121.61,42.62 124.87,39.37 J8.15
SPI1_MOSI  (via drill 0.25)
  Top 0.305: CPU1.69 97.55,40.5 97.89,40.84 104.17,40.84 104.43,40.58 104.44,40.59 v104.9,40.59 | v109.96,40.59 113.67,40.59 v114.28,39.98 | v121.56,40.01 123.47,41.91 124.46,41.91 124.48,41.88 v124.51,41.88
  Bottom 0.305: v104.9,40.59 v109.96,40.59 | v114.28,39.98 114.88,39.37 120.93,39.37 v121.56,40.01 | v124.51,41.88 129.51,41.88 J8.16
SPI1_SCLK  (via drill 0.25)
  Top 0.305: CPU1.71 96.95,40.74 97.56,41.35 v104.75,41.35 | v109.96,41.35 113.79,41.35 v114.25,40.89
  Bottom 0.305: v114.25,40.89 115.72,42.37 120.19,42.37 125.73,36.83 J8.14 | v104.75,41.35 v109.96,41.35
TX_N
  Top 0.254: J5.8 18.41,21.38 19.52,22.48 20.34,22.48 25.85,16.96 | 25.85,16.96 27.42,15.39 32.22,15.39 34.42,17.59 U5.56 | R4.1 25.49,16.6 25.85,16.96
TX_P  (via drill 0.25)
  Top 0.254: J5.7 17.14,20.68 19.35,22.89 20.51,22.89 27.59,15.8 32.05,15.8 32.71,16.46 | U5.55 33.59,17.45 33.59,17.34 32.89,16.64 32.71,16.46 | v31.9,16.46 32.71,16.46
  Bottom 0.254: R3.1 30.09,16.46 v31.9,16.46
USB_D_N  (1 unrouted)
  Top 0.229: 52.47,47.39 52.47,40.52
  Top 0.254: 52.47,40.52 57.23,35.76 67.63,35.76 68.25,36.38 68.25,37.11 68.15,37.21 CPU1.167
USB_D_P
  Top 0.229: U6.1 52.07,40.35
  Top 0.254: 52.07,40.35 57.07,35.36 67.8,35.36 68.66,36.21 68.66,37.11 68.76,37.21 CPU1.165
VBUSB
  Top 0.356: R16.2 Q1.1 46.99,48.23 47.7,48.23 50.27,50.79 50.27,51.53 50.46,51.72 53.03,51.72 53.23,51.53 53.23,50.84 J3.VBUS 53.4,50.72 JP1.1

## Text on the board
tPlace: PoolTable CPU Module / Created by DART 2019 / Released under the GPLv3 | Rev A
tNames: 0 | AUTO MDIX | 1 | ACT